# Altium schematic sheet Power_Supply.SchDoc
size Letter; Organization: Altium Limited; Address1: L3, 12a Rodborough Rd; Address2: Frenchs Forest; Address3: NSW; Address4: Australia 2086
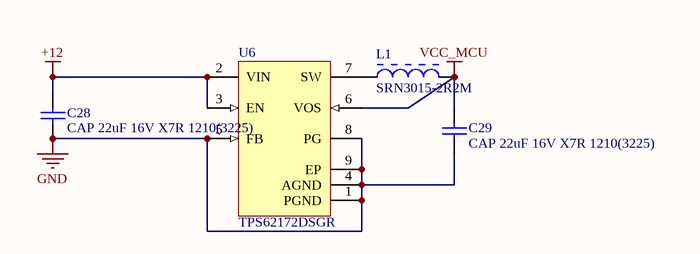
[diagram p0: Power_Supply.SchDoc]

## Parts
C28  CAP 22uF 16V X7R 1210(3225)  [CAPC1210(3225)280_L]
C29  CAP 22uF 16V X7R 1210(3225)  [CAPC1210(3225)280_L]
L1  SRN3015-2R2M  [BOUR-SRN3015-2_V]
U6  TPS62172DSGR  [DSG8-1600X900TP]

## Nets
+12: C28.2 U6.2(VIN) U6.3(EN)
GND: C28.1 C29.1 U6.1(PGND) U6.4(AGND) U6.5(FB) U6.8(PG) U6.9(EP)
VCC_MCU: C29.2 L1.2 U6.6(VOS)
NetL1_1: L1.1 U6.7(SW)

## Notes on the sheet
- Title
- Size:
- Date:
- Letter
- Number:
- Time:
- Revision:
- Sheet
- of
- File:

## Library data of the parts
C28 C29 = CMP-1038-02277-1: CAP 22uF 16V ±10% 1210 (3225 Metric) Thickness 2.8mm SMD; Case-Metric: 3225; Case-EIA: 1210; Tolerance: Â±10%; Rated Voltage: 16 V; Technology: SMT; Value: 22uF; Max Thickness: 2.8 mm
L1 = CMP-0007-00003-1: Semi-shielded Power Inductor, 2.2 uH, +/- 20%, 1.8 A, -40 to 125 degC, 3 x 3 x 1.5 mm SMD, RoHS and Halogen Free, Tape and Reel; Manufacturer: Bourns; Isat: 1.65 A; Rated current: 1.8 A; Inductance: 2.2 uH; Inductance tolerance: +/- 20%; DCR Max: 0.072 Ohm; SRF Min: 90 MHz; Resistance to Solder Heat: +260 degC for 10 sec.; Operating Temperature: -40 to 125 degC; PartNumber: SRN3015-2R2M; Packing: Tape and Reel; ComponentLink3Description: Package Specification; ComponentLink2Description: Datasheet; RoHS: TRUE; ComponentLink3URL: http://www.bourns.com/data/global/pdfs/SRN3015.pdf; PackageDescription: 2-Pin SMD, Body 3 x 3 mm, Height 1.5 mm; ComponentLink1URL: http://www.bourns.com/; ComponentLink1Description: Manufacturer URL; DatasheetVersion: Aug-11; Mounting Technology: Surface Mount; ComponentLink2URL: http://www.bourns.com/data/global/pdfs/SRN3015.pdf; PackageReference: SRN3015
U6 = TPS62172DSGR: Buck Step Down Regulator with 3 to 17 V Input and 3.3 V Output, -40 to 85 degC, 8-Pin WSON (DSG), Green (RoHS & no Sb/Br); Manufacturer: Texas Instruments; Vout(Min)(V): 3.3; Vin(Min)(V): 3; Duty Cycle(Max)(%): 100; SubFamily: Step-Down Regulator; Iq(Typ)(mA): 0.017; Vin(Max)(V): 17; Synchronous Rectification: TRUE; Regulated Outputs(#): 1; Rating: Catalog; Switch Current Limit(Typ)(A): 1.05; Iout(Max)(A): 0.5; Vout(Max)(V): 3.3; Preset Vout(V): 3.3; Topology: Buck; Eco-Plan: Green (RoHS & no Sb/Br); PartNumber: TPS62172DSGR; ComponentLink1Description: Datasheet; ComponentLink2Description: Package Specification; DatasheetVersion: SLVSAT8A; ComponentLink3URL: Samples URL:http://www.ti.com/product/tps62172#samples; ComponentLink1URL: http://www.ti.com/general/docs/lit/getliterature.tsp?genericPartNumber=TPS62172&fileType=pdf; Code_JEDEC: MO-229; ComponentLink2URL: http://www.ti.com/litv/pdf/mpds308a; ComponentLink3Description: URL Link1; PackageVersion: revB, Oct-2010; Mounting Technology: Surface Mount; PackageReference: DSG8-1600X900TP; PackageDescription: 8-Pin Plastic Small Outline No-Lead, 2 x 2 x 0.8 mm Body, 0.5 mm Pitch, Exposed Pad